# EAGLE design apollo-sensor-v4 (EAGLE 9.6.2)
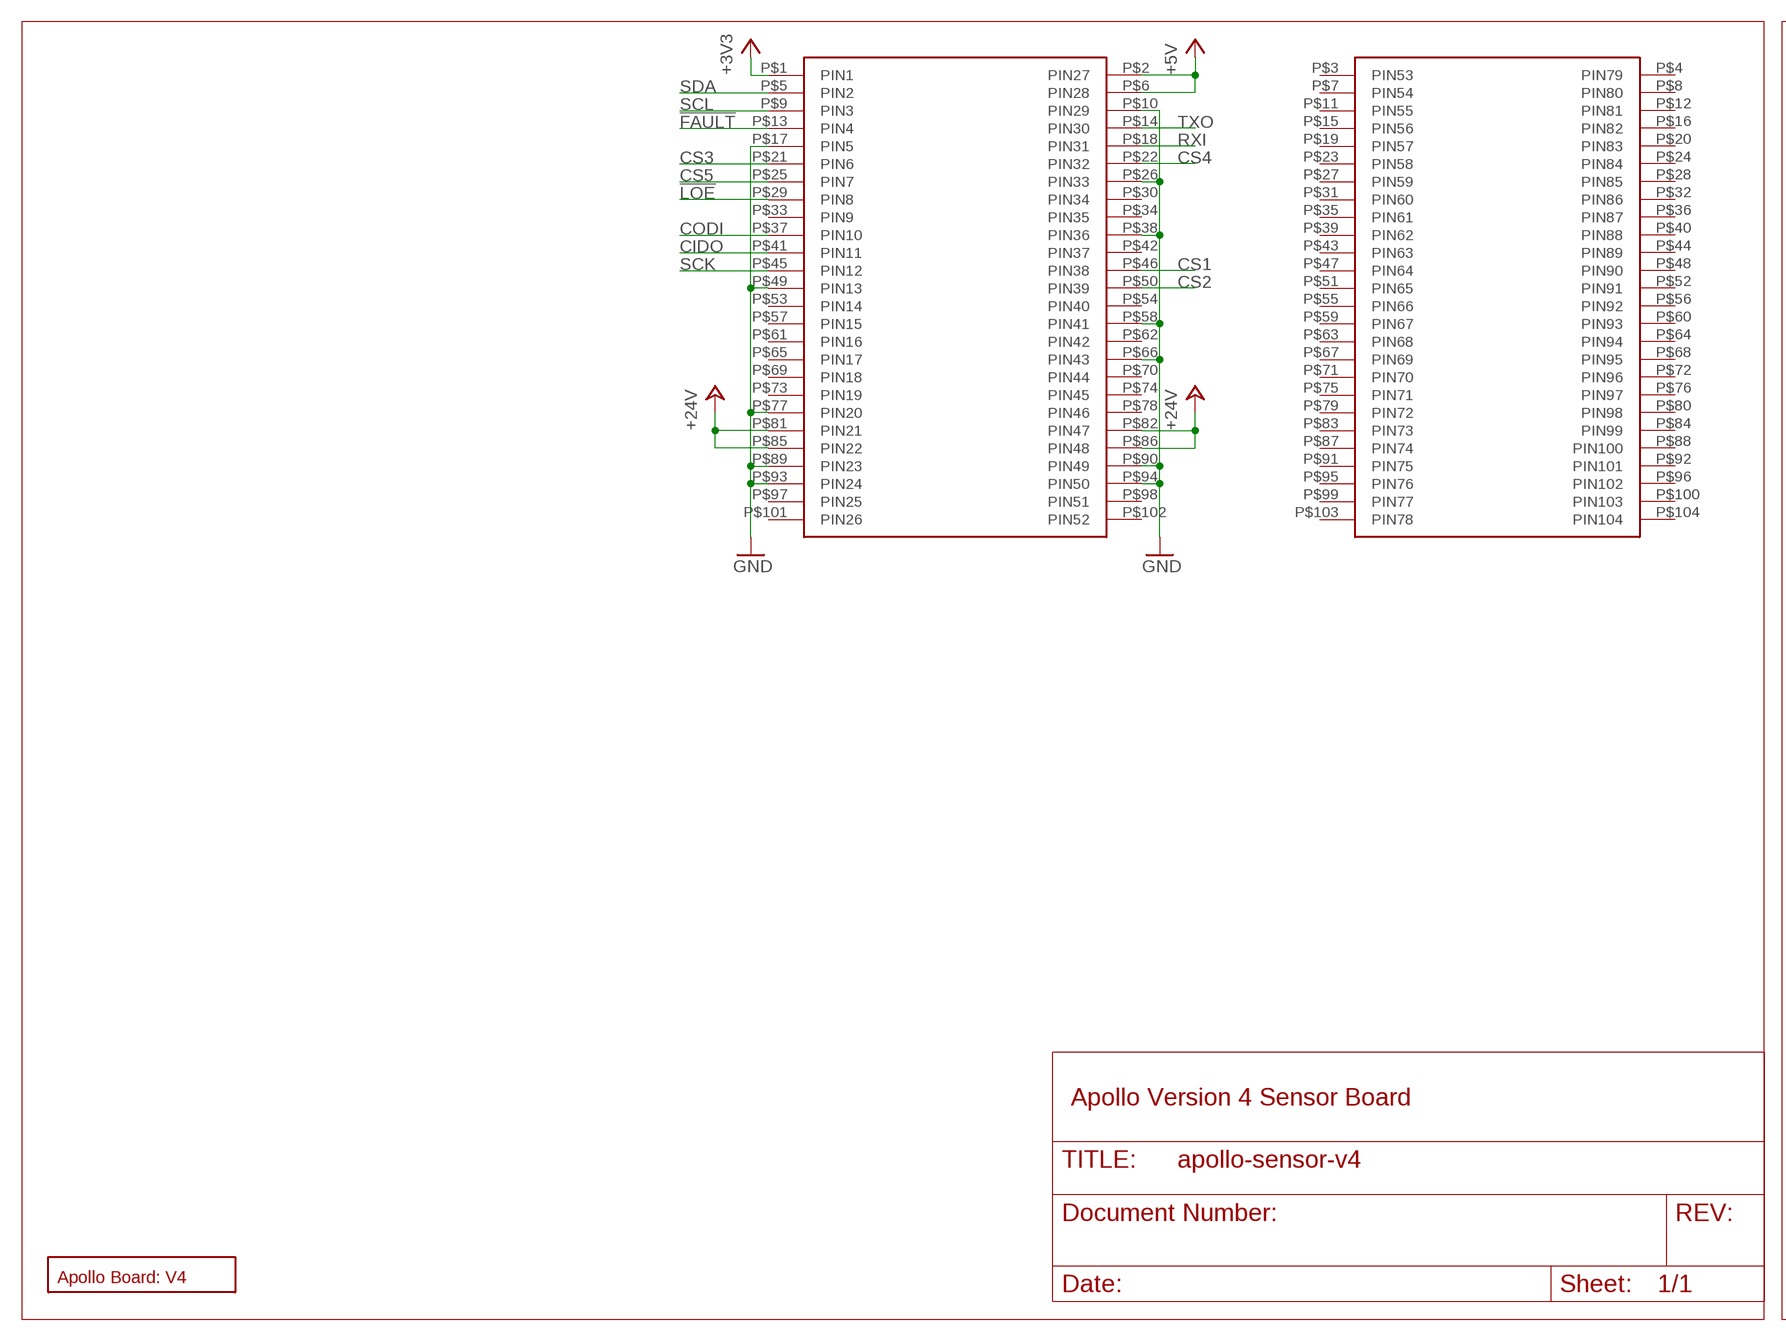
[diagram p0: schematic, sheet 1, part 1 of 2]
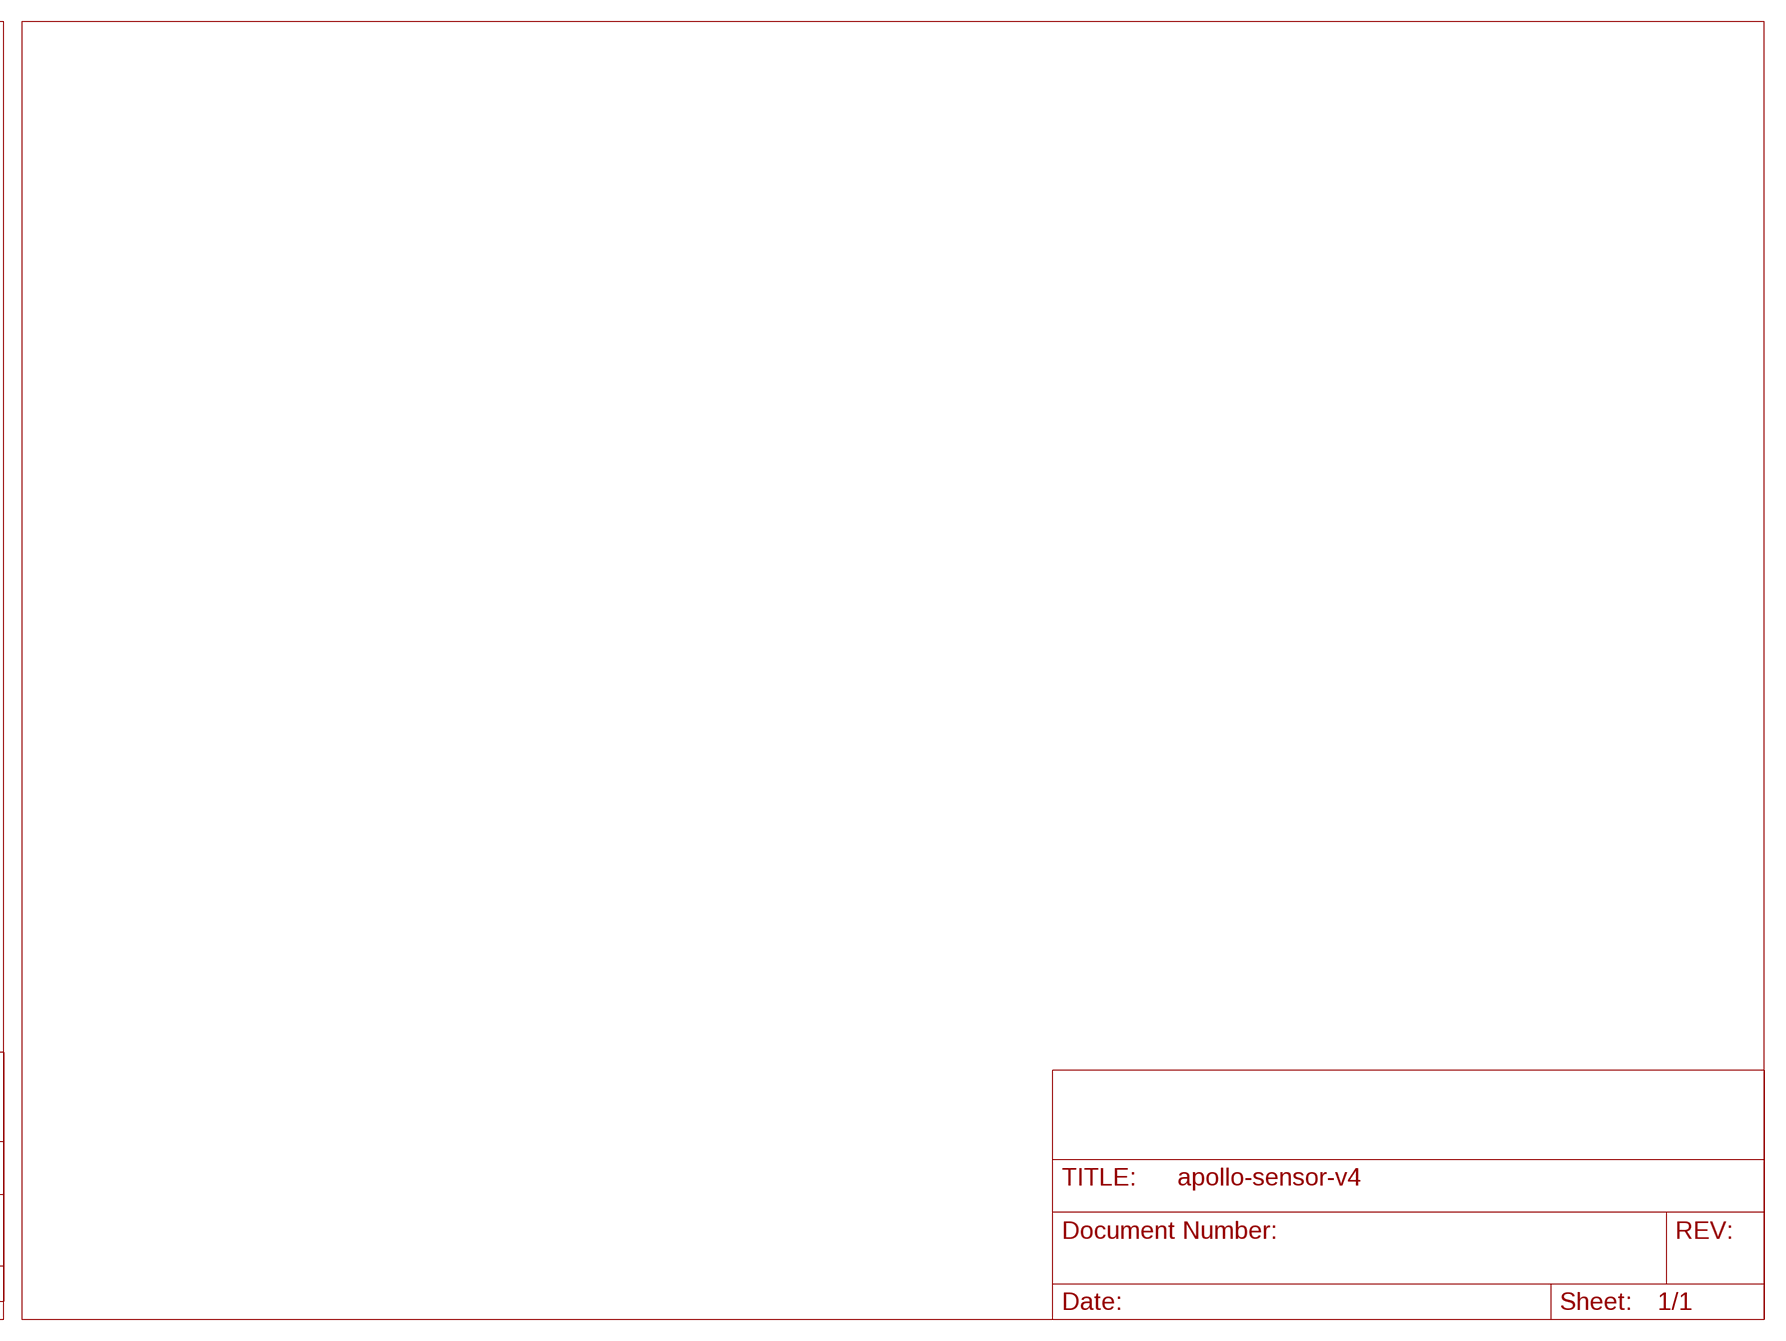
[diagram p1: schematic, sheet 1, part 2 of 2]

## Parts
U$1  PC104_CONNECTOR  [PC104_CONNECTOR]
U$2  BOARD_TEMPLATE1  [BOARD_TEMPLATE]

## Nets
!FAULT!: U$1.P$13(PIN4)
!LOE!: U$1.P$29(PIN8)
+3V3: U$1.P$1(PIN1)
+5V: U$1.P$2(PIN27) U$1.P$6(PIN28)
+24V: U$1.P$81(PIN21) U$1.P$82(PIN47) U$1.P$85(PIN22) U$1.P$86(PIN48)
CIDO: U$1.P$41(PIN11)
CODI: U$1.P$37(PIN10)
CS1: U$1.P$46(PIN38)
CS2: U$1.P$50(PIN39)
CS3: U$1.P$21(PIN6)
CS4: U$1.P$22(PIN32)
CS5: U$1.P$25(PIN7)
GND: U$1.P$10(PIN29) U$1.P$17(PIN5) U$1.P$26(PIN33) U$1.P$38(PIN36) U$1.P$49(PIN13) U$1.P$58(PIN41) U$1.P$66(PIN43) U$1.P$77(PIN20) U$1.P$89(PIN23) U$1.P$90(PIN49) U$1.P$93(PIN24) U$1.P$94(PIN50)
RXI: U$1.P$18(PIN31)
SCK: U$1.P$45(PIN12)
SCL: U$1.P$9(PIN3)
SDA: U$1.P$5(PIN2)
TXO: U$1.P$14(PIN30)
Unconnected: U$1.P$3(PIN53) U$1.P$4(PIN79) U$1.P$7(PIN54) U$1.P$8(PIN80) U$1.P$11(PIN55) U$1.P$12(PIN81) U$1.P$15(PIN56) U$1.P$16(PIN82) U$1.P$19(PIN57) U$1.P$20(PIN83) U$1.P$23(PIN58) U$1.P$24(PIN84) U$1.P$27(PIN59) U$1.P$28(PIN85) U$1.P$30(PIN34) U$1.P$31(PIN60) U$1.P$32(PIN86) U$1.P$33(PIN9) U$1.P$34(PIN35) U$1.P$35(PIN61) U$1.P$36(PIN87) U$1.P$39(PIN62) U$1.P$40(PIN88) U$1.P$42(PIN37) U$1.P$43(PIN63) U$1.P$44(PIN89) U$1.P$47(PIN64) U$1.P$48(PIN90) U$1.P$51(PIN65) U$1.P$52(PIN91) U$1.P$53(PIN14) U$1.P$54(PIN40) U$1.P$55(PIN66) U$1.P$56(PIN92) U$1.P$57(PIN15) U$1.P$59(PIN67) U$1.P$60(PIN93) U$1.P$61(PIN16) U$1.P$62(PIN42) U$1.P$63(PIN68) U$1.P$64(PIN94) U$1.P$65(PIN17) U$1.P$67(PIN69) U$1.P$68(PIN95) U$1.P$69(PIN18) U$1.P$70(PIN44) U$1.P$71(PIN70) U$1.P$72(PIN96) U$1.P$73(PIN19) U$1.P$74(PIN45) U$1.P$75(PIN71) U$1.P$76(PIN97) U$1.P$78(PIN46) U$1.P$79(PIN72) U$1.P$80(PIN98) U$1.P$83(PIN73) U$1.P$84(PIN99) U$1.P$87(PIN74) U$1.P$88(PIN100) U$1.P$91(PIN75) U$1.P$92(PIN101) U$1.P$95(PIN76) U$1.P$96(PIN102) U$1.P$97(PIN25) U$1.P$98(PIN51) U$1.P$99(PIN77) U$1.P$100(PIN103) U$1.P$101(PIN26) U$1.P$102(PIN52) U$1.P$103(PIN78) U$1.P$104(PIN104)

## Notes on the sheet
- Apollo Version 4 Sensor Board

## Library data of the parts
U$1 = template_board:PC104_CONNECTOR
U$2 = template_board:BOARD_TEMPLATE

## Board
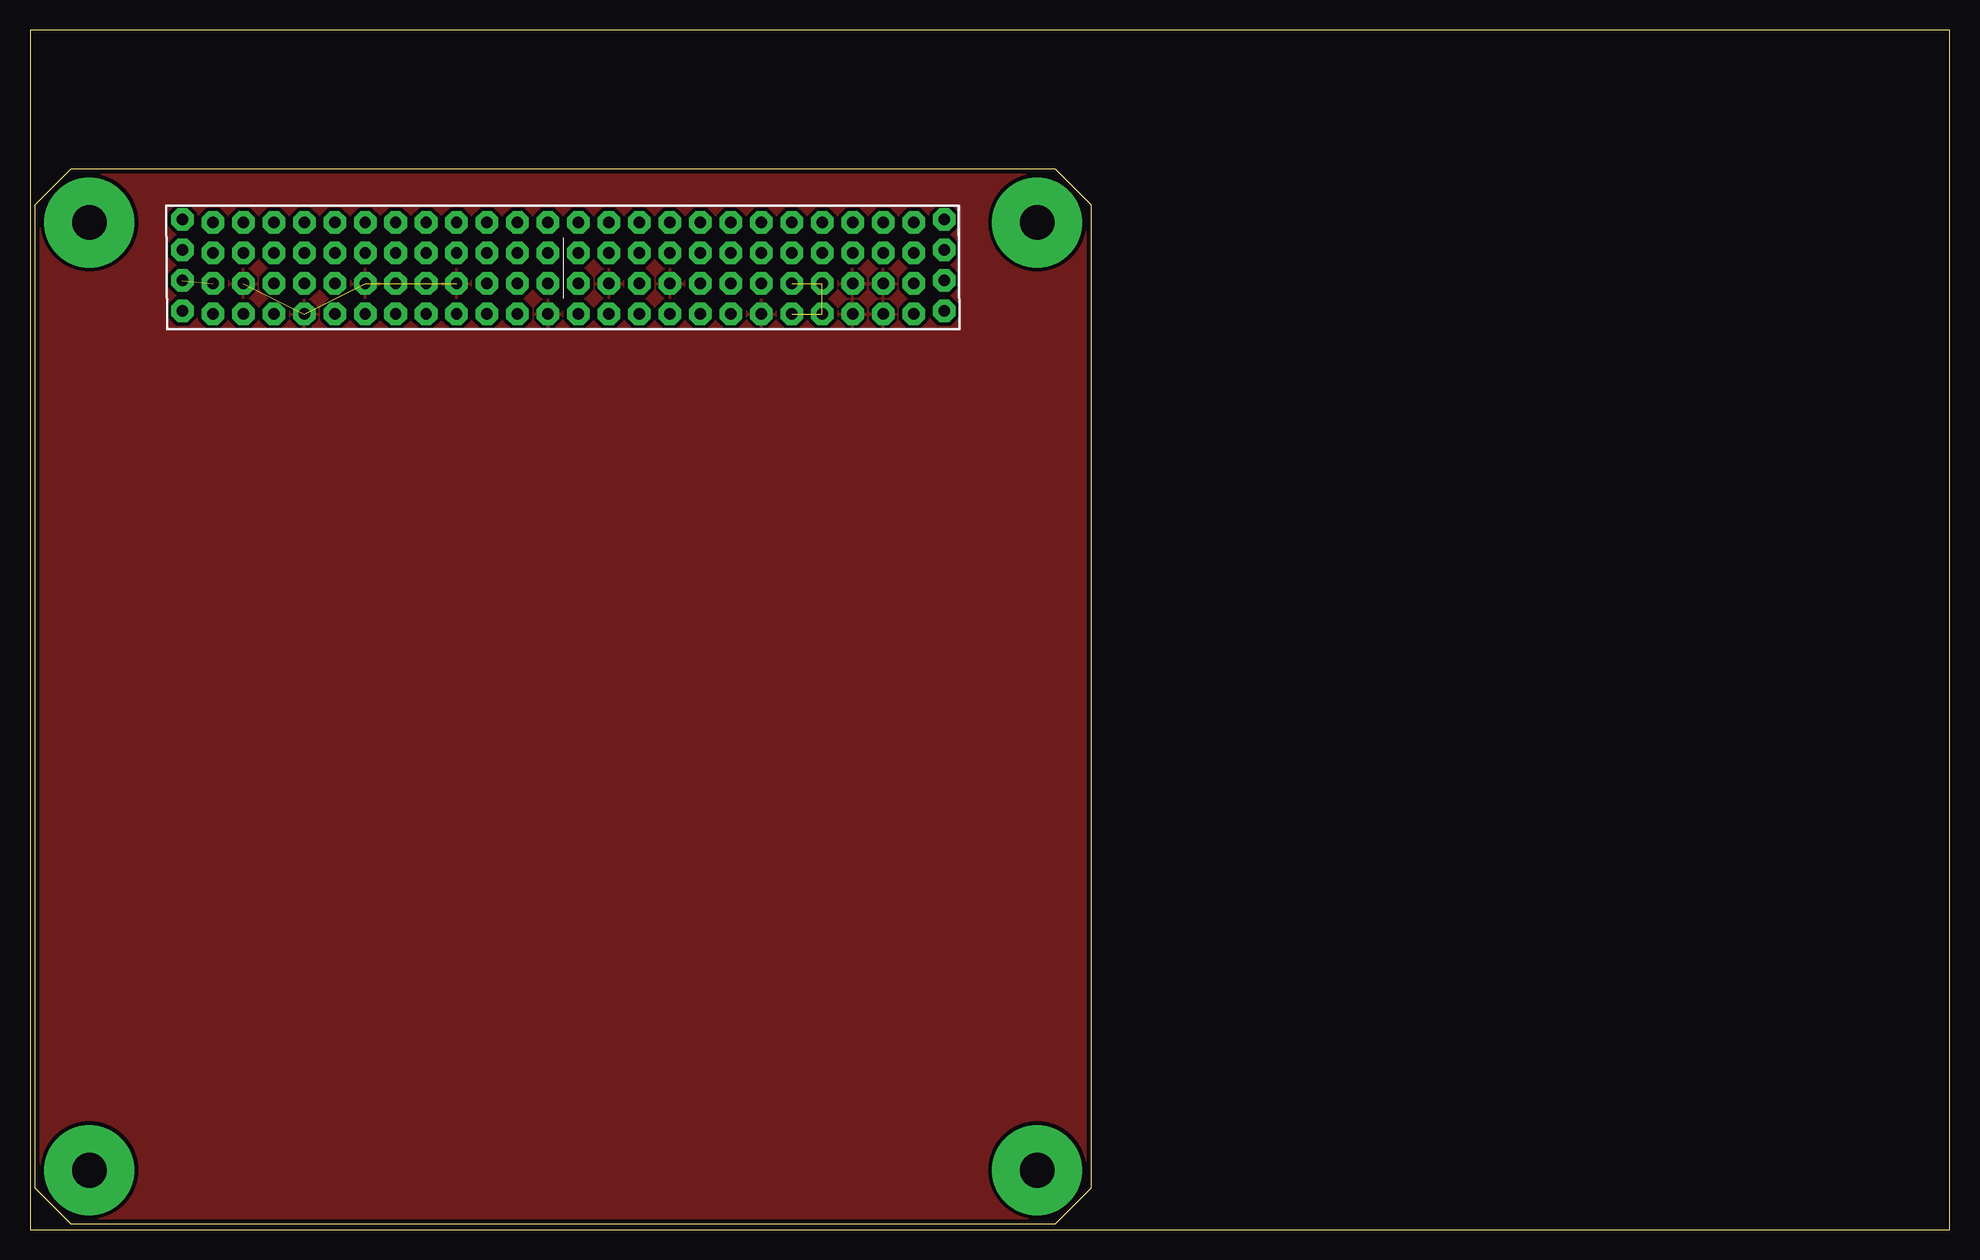
[diagram p2: board, top side]
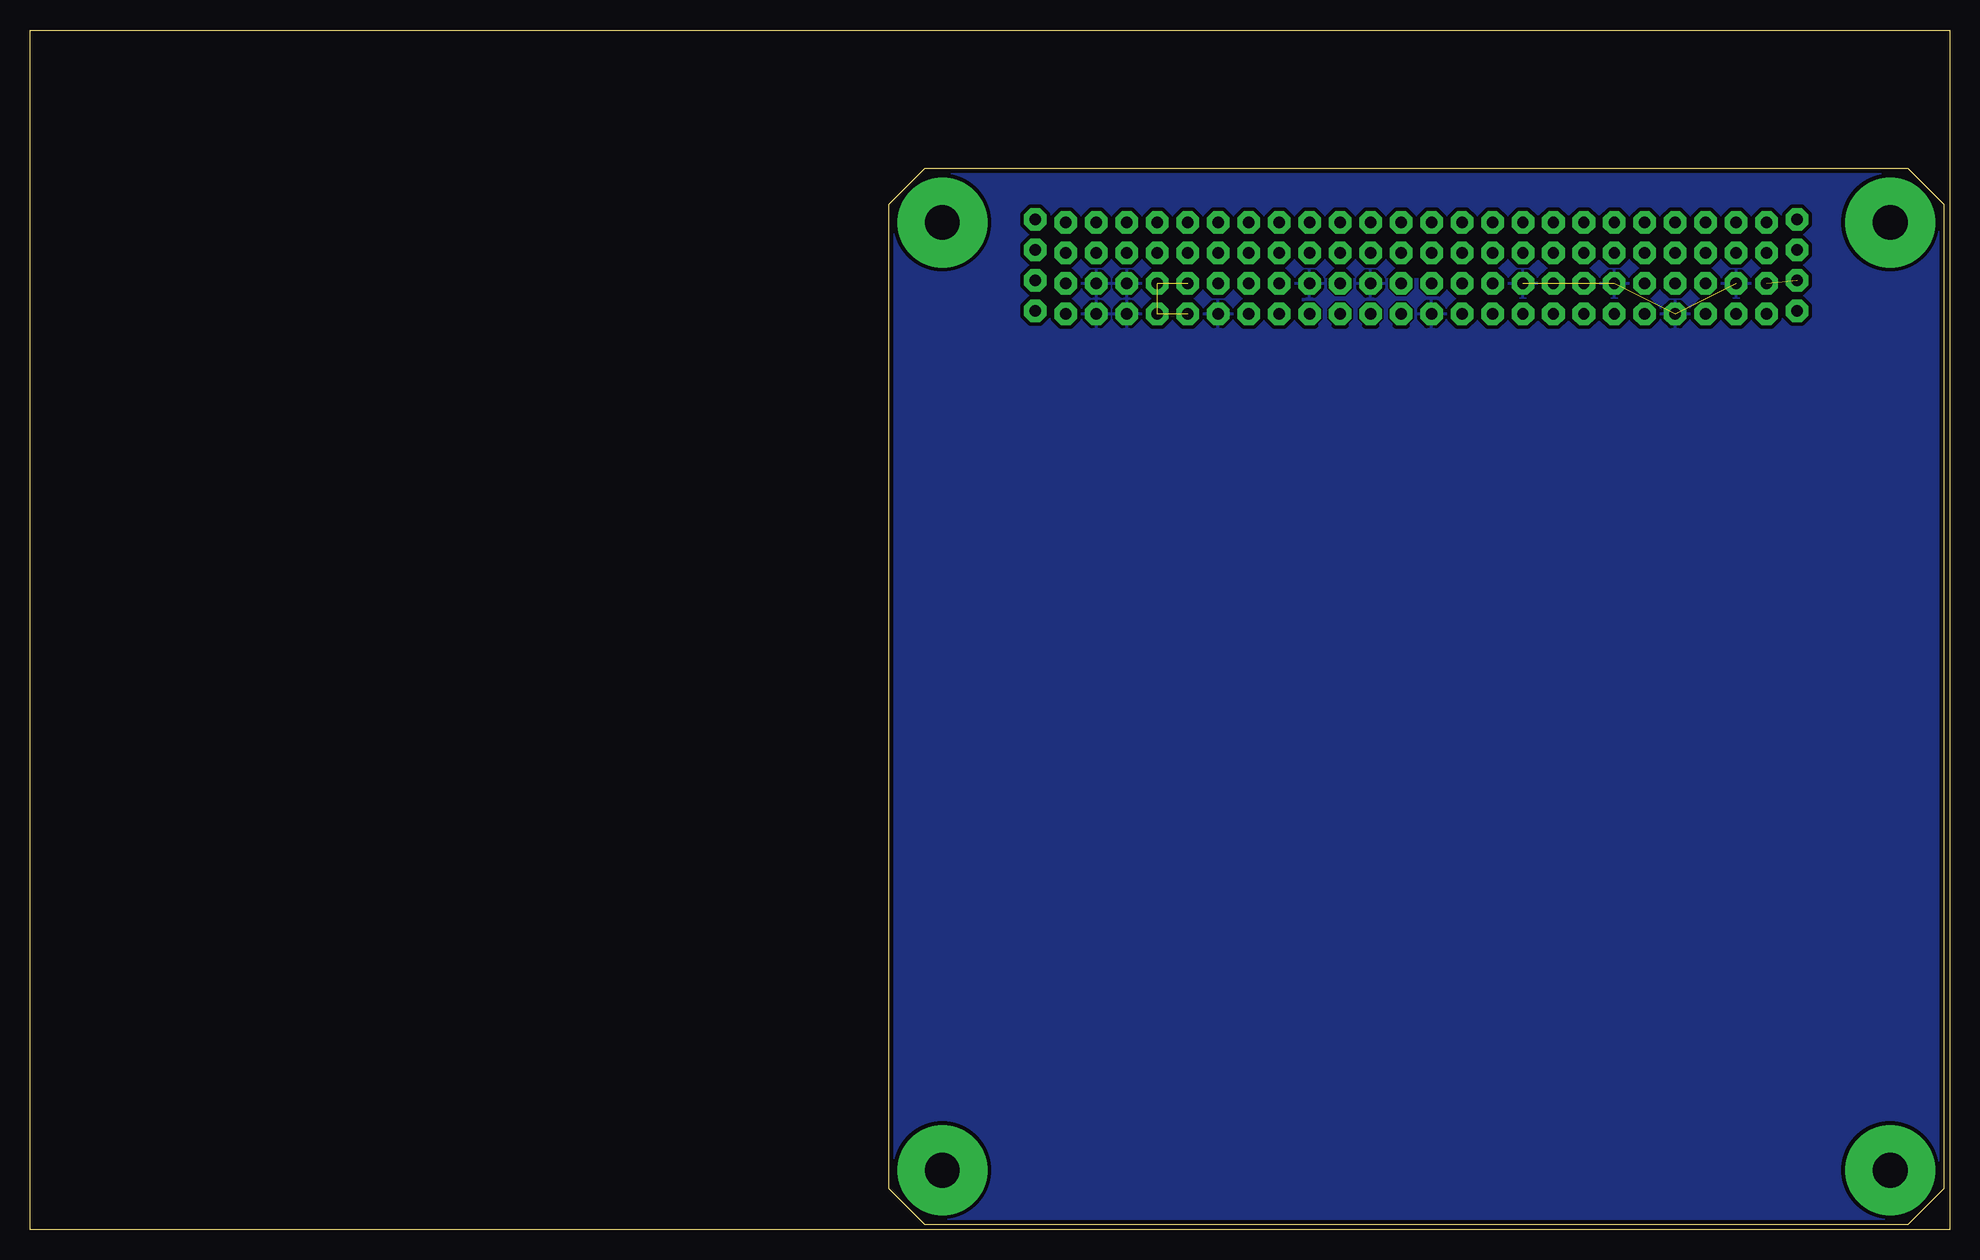
[diagram p3: board, bottom side, seen from below]

Size 160 x 100 mm. Coordinates in mm from the lower left corner, seen from the top.
Outline: 0,0 160,0 160,100 0,100 0,0
Copper layers (1*2*15*16): Top 0.035559375mm / dielectric 0.17018125mm / Route2 0.01778125mm / dielectric 47mil / Route15 0.01778125mm / dielectric 0.17018125mm / Bottom 0.035559375mm
Design rules "oshpark-4layer *": minimum track width 5mil, minimum drill 10mil, track to track 5mil, track to pad 5mil, pad to pad 5mil, via to via 5mil, smd to smd 5mil, copper to edge 15mil, drill to drill 6mil, minimum pad ring 4mil, minimum via ring 4mil, stop-mask expansion 1.5mil, vias tented up to drill 0mil, thermal gap 10mil

### Footprints (pad centres in the part's own frame; a part is rotated, then mirrored left to right if it is on the bottom)
PC104_CONNECTOR = drill 0.953 pad 1.88 octagon: P$1 -31.75,32.134; P$2 -31.75,34.674; P$3 -31.75,37.214; P$4 -31.75,39.754; P$5 -29.21,31.88; P$6 -29.21,34.42; P$7 -29.21,36.96; P$8 -29.21,39.5; P$9 -26.67,31.88; P$10 -26.67,34.42; P$11 -26.67,36.96; P$12 -26.67,39.5; P$13 -24.13,31.88; P$14 -24.13,34.42; P$15 -24.13,36.96; P$16 -24.13,39.5; P$17 -21.59,31.88; P$18 -21.59,34.42; P$19 -21.59,36.96; P$20 -21.59,39.5; P$21 -19.05,31.88; P$22 -19.05,34.42; P$23 -19.05,36.96; P$24 -19.05,39.5; P$25 -16.51,31.88; P$26 -16.51,34.42; P$27 -16.51,36.96; P$28 -16.51,39.5; P$29 -13.97,31.88; P$30 -13.97,34.42; P$31 -13.97,36.96; P$32 -13.97,39.5; P$33 -11.43,31.88; P$34 -11.43,34.42; P$35 -11.43,36.96; P$36 -11.43,39.5; P$37 -8.89,31.88; P$38 -8.89,34.42; P$39 -8.89,36.96; P$40 -8.89,39.5; P$41 -6.35,31.88; P$42 -6.35,34.42; P$43 -6.35,36.96; P$44 -6.35,39.5; P$45 -3.81,31.88; P$46 -3.81,34.42; P$47 -3.81,36.96; P$48 -3.81,39.5; P$49 -1.27,31.88; P$50 -1.27,34.42; P$51 -1.27,36.96; P$52 -1.27,39.5; P$53 1.27,31.88; P$54 1.27,34.42; P$55 1.27,36.96; P$56 1.27,39.5; P$57 3.81,31.88; P$58 3.81,34.42; P$59 3.81,36.96; P$60 3.81,39.5; P$61 6.35,31.88; P$62 6.35,34.42; P$63 6.35,36.96; P$64 6.35,39.5; P$65 8.89,31.88; P$66 8.89,34.42; P$67 8.89,36.96; P$68 8.89,39.5; P$69 11.43,31.88; P$70 11.43,34.42; P$71 11.43,36.96; P$72 11.43,39.5; P$73 13.97,31.88; P$74 13.97,34.42; P$75 13.97,36.96; P$76 13.97,39.5; P$77 16.51,31.88; P$78 16.51,34.42; P$79 16.51,36.96; P$80 16.51,39.5; P$81 19.05,31.88; P$82 19.05,34.42; P$83 19.05,36.96; P$84 19.05,39.5; P$85 21.59,31.88; P$86 21.59,34.42; P$87 21.59,36.96; P$88 21.59,39.5; P$89 24.13,31.88; P$90 24.13,34.42; P$91 24.13,36.96; P$92 24.13,39.5; P$93 26.67,31.88; P$94 26.67,34.42; P$95 26.67,36.96; P$96 26.67,39.5; P$97 29.21,31.88; P$98 29.21,34.42; P$99 29.21,36.96; P$100 29.21,39.5; P$101 31.75,32.134; P$102 31.75,34.674; P$103 31.75,37.214; P$104 31.75,39.754
BOARD_TEMPLATE = drill 2.9 pad 7.5: P$1 -39.5,39.5; P$2 -39.5,-39.5; P$3 39.5,-39.5; P$4 39.5,39.5

### Placement (x,y rotation side)
U$1  44.45,44.45 0 top
U$2  44.45,44.45 0 top

### Tracks (layer width: path | path; a pad name or v marks a point on that pad's centre or on a via)
+5V  (1 unrouted)
+24V  (3 unrouted)
GND  (3 unrouted)
  pour Top (isolate 0.305, rank 4): 0,88.9 0,0 88.9,0 88.9,88.9
  pour Bottom (isolate 0.305, rank 4): 0,88.9 0,0 87.63,0 88.9,1.27 88.9,88.9
  pour Bottom (isolate 0.152, rank 3): 42.67,75.44 53.85,75.44 53.85,79.25 42.67,79.25